# EAGLE design tinyPipes-tinyComponents (EAGLE 6.5.0)

## Sheet 1 of 3
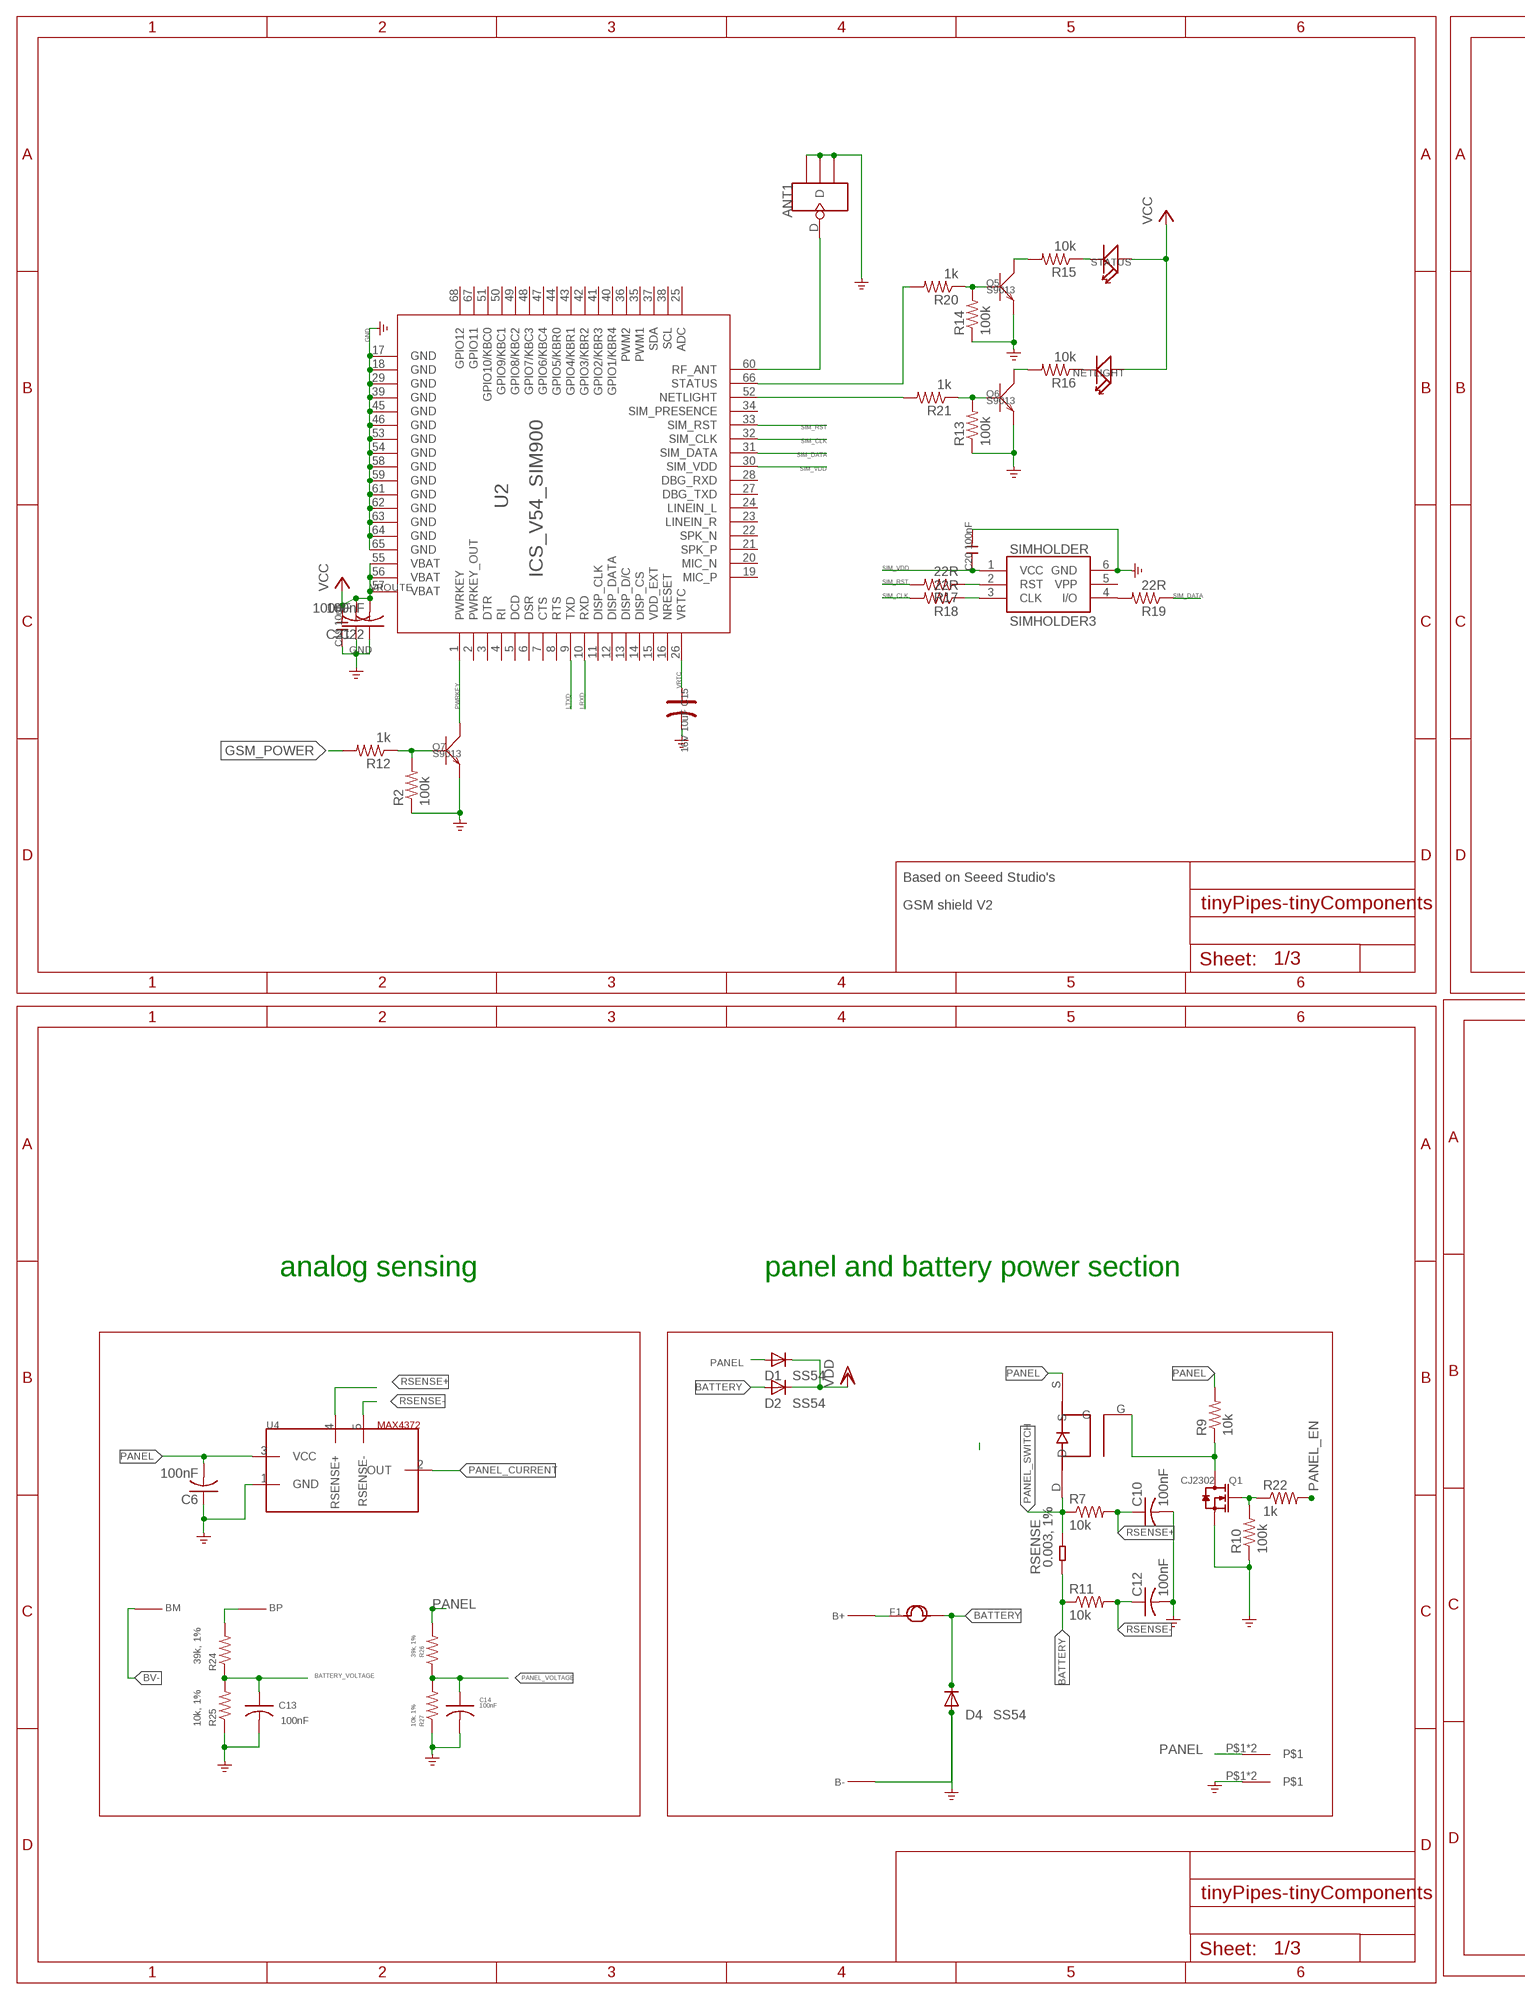
[diagram p0: schematic, sheet 1, part 1 of 2]
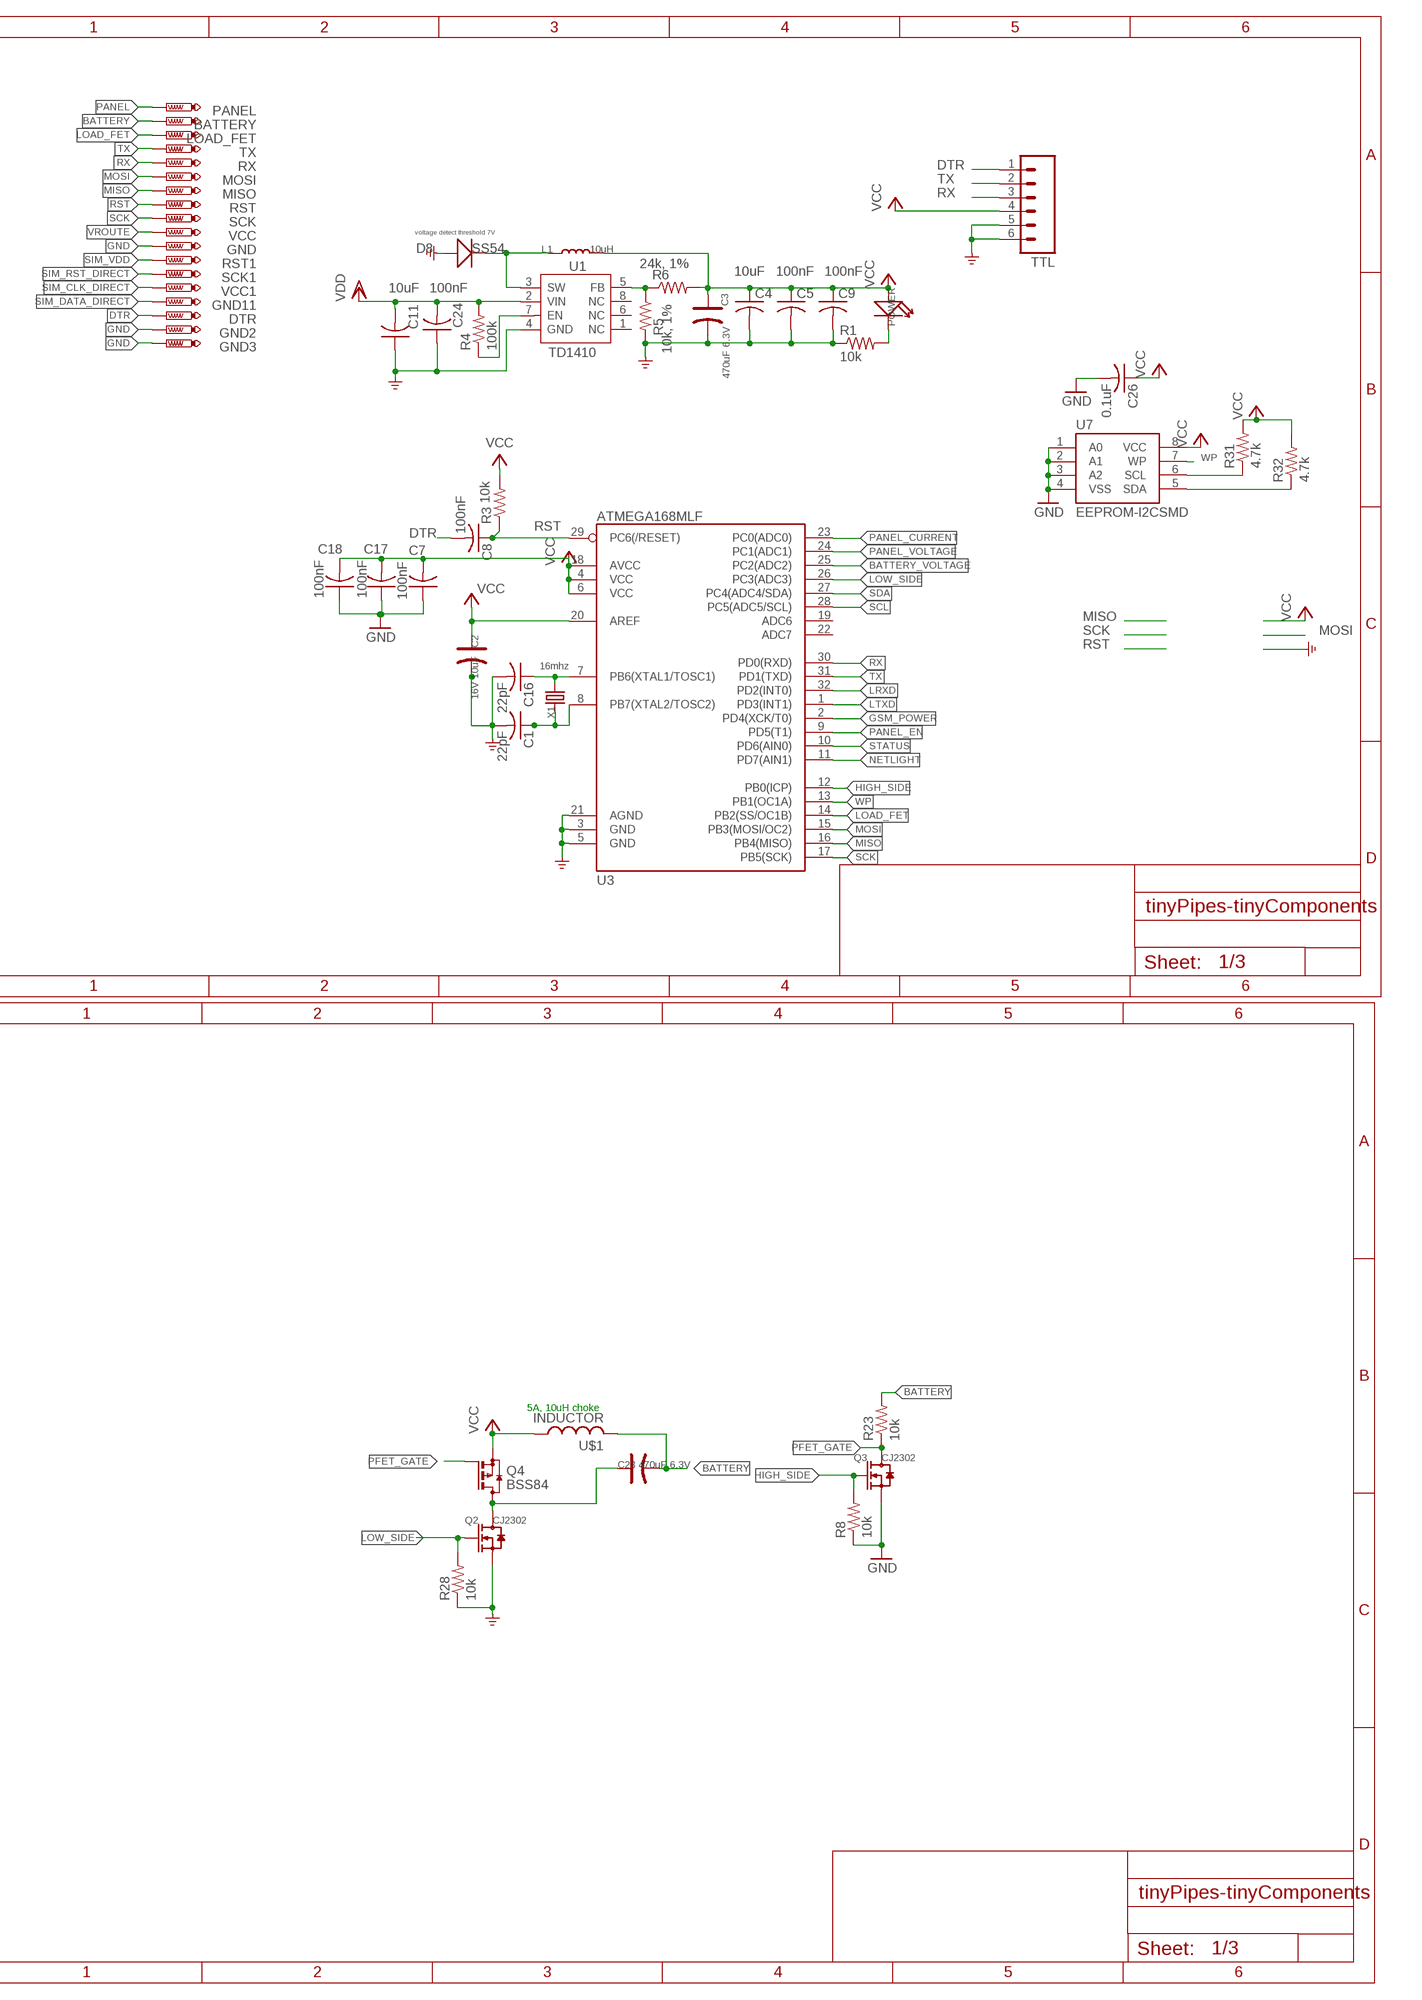
[diagram p1: schematic, sheet 1, part 2 of 2]

### Parts
ANT1  ANTENNA-U-FL  [4P-U-FL]
B+  TINYPIPES_BATTBATT  [TINYPIPES_BATT]
B-  TINYPIPES_BATTBATT  [TINYPIPES_BATT]
BATTERY  PTR1B2,54  [B2,54]
BM  TINYPIPES_BATTSBATT  [TINYPIPES_SBATT]
BP  TINYPIPES_BATTSBATT  [TINYPIPES_SBATT]
C1  22pF  C-USC0201  [C0201]
C2  16V 10uF  CAP-AVX-A  [AVX-A]
C3  470uF 6.3V  CAP-AVX-D  [AVX-D]
C4  10uF  C-USC0805  [C0805]
C5  100nF  C-USC0402  [C0402]
C6  100nF  C-USC0402  [C0402]
C7  100nF  C-USC0402  [C0402]
C8  100nF  C-USC0402  [C0402]
C9  100nF  C-USC0402  [C0402]
C10  100nF  C-USC0402  [C0402]
C11  10uF  C-USC0402  [C0402]
C12  100nF  C-USC0402  [C0402]
C13  100nF  C-USC0402  [C0402]
C14  100nF  C-USC0402  [C0402]
C15  16V 10uF  CAP-AVX-A  [AVX-A]
C16  22pF  C-USC0201  [C0201]
C17  100nF  C-USC0402  [C0402]
C18  100nF  C-USC0402  [C0402]
C19  10uF  C-0805  [C0805]
C20  100nF  C-0603  [C0603]
C21  100nF  C-USC0402  [C0402]
C22  100nF  C-USC0402  [C0402]
C23  470uF 6.3V  CAP-AVX-D  [AVX-D]
C24  100nF  C-USC0402  [C0402]
C26  0.1uF  C-USC0402  [C0402]
D1  SS54  DIODE-SMB  [SMB]
D2  SS54  DIODE-SMB  [SMB]
D4  SS54  DIODE-SMB  [SMB]
D8  SS54  D'MBRS240LT3'  [SMB]
DTR  PTR1B2,54  [B2,54]
F1  FUSE16R700  [0210]
GND  PTR1B2,54  [B2,54]
GND2  PTR1B2,54  [B2,54]
GND3  PTR1B2,54  [B2,54]
GND11  PTR1B2,54  [B2,54]
L1  10uH  L'0630'  [L0630]
LOAD_FET  PTR1B2,54  [B2,54]
MISO  PTR1B2,54  [B2,54]
MOSI  PTR1B2,54  [B2,54]
NETLIGHT  LED'0603'  [LED-0603]
PANEL  PTR1B2,54  [B2,54]
PANEL+  TINYPIPES_BATTPANEL  [TINYPIPES_PANEL]
PANEL-  TINYPIPES_BATTPANEL  [TINYPIPES_PANEL]
POWER  LED'0603'  [LED-0603]
Q1  CJ2302  MOSFET-N'SOT23'  [SOT23]
Q2  CJ2302  MOSFET-N'SOT23'  [SOT23]
Q3  CJ2302  MOSFET-N'SOT23'  [SOT23]
Q4  BSS84  [SOT23]
Q5  S9013  TRANSISTOR-NPN-SOT23  [SOT23]
Q6  S9013  TRANSISTOR-NPN-SOT23  [SOT23]
Q7  S9013  TRANSISTOR-NPN-SOT23  [SOT23]
R1  10k  R-US_R0201  [R0201]
R2  100k  R-US_R0201  [R0201]
R3  10k  R-US_R0201  [R0201]
R4  100k  R-US_R0201  [R0201]
R5  10k, 1%  R-US_R0201  [R0201]
R6  24k, 1%  R-US_R0201  [R0201]
R7  10k  R-US_R0201  [R0201]
R8  10k  R-US_R0201  [R0201]
R9  10k  R-US_R0201  [R0201]
R10  100k  R-US_R0201  [R0201]
R11  10k  R-US_R0201  [R0201]
R12  1k  R-US_R0201  [R0201]
R13  100k  R-US_R0201  [R0201]
R14  100k  R-US_R0201  [R0201]
R15  10k  R-US_R0201  [R0201]
R16  10k  R-US_R0201  [R0201]
R17  22R  R-US_R0201  [R0201]
R18  22R  R-US_R0201  [R0201]
R19  22R  R-US_R0201  [R0201]
R20  1k  R-US_R0201  [R0201]
R21  1k  R-US_R0201  [R0201]
R22  1k  R-US_R0201  [R0201]
R23  10k  R-US_R0201  [R0201]
R24  39k, 1%  R-US_R0201  [R0201]
R25  10k, 1%  R-US_R0201  [R0201]
R26  39k, 1%  R-US_R0201  [R0201]
R27  10k, 1%  R-US_R0201  [R0201]
R28  10k  R-US_R0201  [R0201]
R31  4.7k  R-US_R0201  [R0201]
R32  4.7k  R-US_R0201  [R0201]
RSENSE  0.003, 1%  R-2512  [R2512]
RST  PTR1B2,54  [B2,54]
RST1  PTR1B2,54  [B2,54]
RX  PTR1B2,54  [B2,54]
SCK  PTR1B2,54  [B2,54]
SCK1  PTR1B2,54  [B2,54]
SIMHOLDER  SIMHOLDER3  [SIMHOLDER3]
STATUS  LED'0603'  [LED-0603]
TTL  M06LOCK  [1X06_LOCK]
TX  PTR1B2,54  [B2,54]
U1  TD1410  [SOP8]
U2  ICS_V54_SIM900  [ICS_V54_SIM900]
U3  ATMEGA168MLF  [MLF32]
U4  MAX4372  [SOT23-5]
U5  SI4435POWER  [SO8_FET]
U7  EEPROM-I2CSMD  [SO08]
U$1  INDUCTOR  [10UH_5A_INDUCTOR]
VCC  PTR1B2,54  [B2,54]
VCC1  PTR1B2,54  [B2,54]
X1  16mhz  CRYSTAL  [SMD-4_CRYSTAL]

### Nets
B+: B+.1 F1.1
B-: B-.1 D4.A
BATTERY [power]: BATTERY.TP C23.- D2.A D4.C F1.2 R11.1 R23.2 RSENSE.1 U$1.P$2
BATTERY_VOLTAGE: C13.1 R24.1 R25.2 U3.25(PC2(ADC2))
BV+: BP.P$1 R24.2
BV-: BM.P$1
DTR: C8.2 DTR.TP TTL.1
GND: ANT1.GND1 ANT1.GND2 ANT1.GND3 C1.2 C2.- C3.- C4.2 C5.2 C6.1 C7.1 C9.2 C10.2 C11.1 C12.2 C13.2 C14.2 C15.- C16.2 C17.1 C18.1 C19.1 C20.2 C21.1 C22.1 C24.1 C26.2 D8.+ GND2.TP GND3.TP GND.TP PANEL-.P$1 PANEL-.P$2 Q1.2(S) Q2.2(S) Q3.2(S) Q5.2(E) Q6.2(E) Q7.2(E) R1.1 R2.1 R5.2 R8.1 R10.1 R13.1 R14.1 R25.1 R27.1 R28.1 SIMHOLDER.6(GND) TTL.5 TTL.6 U1.4(GND) U2.17(GND) U2.18(GND) U2.29(GND) U2.39(GND) U2.45(GND) U2.46(GND) U2.53(GND) U2.54(GND) U2.58(GND) U2.59(GND) U2.61(GND) U2.62(GND) U2.63(GND) U2.64(GND) U2.65(GND) U3.3(GND) U3.5(GND) U3.21(AGND) U4.1(GND) U7.1(A0) U7.2(A1) U7.3(A2) U7.4(VSS)
GSM_POWER: R12.2 U3.2(PD4(XCK/T0))
HIGH_SIDE: Q3.1(G) R8.2 U3.12(PB0(ICP))
LOAD_FET: LOAD_FET.TP U3.14(PB2(SS/OC1B))
LOW_SIDE: Q2.1(G) R28.2 U3.26(PC3(ADC3))
LRXD: U2.10(RXD) U3.32(PD2(INT0))
LTXD: U2.9(TXD) U3.1(PD3(INT1))
MISO: MISO.TP U3.16(PB4(MISO))
MOSI: MOSI.TP U3.15(PB3(MOSI/OC2))
N$1: ANT1.D U2.60(RF_ANT)
N$2: C16.1 U3.7(PB6(XTAL1/TOSC1)) X1.3
N$3: Q6.3(C) R16.2
N$4: Q7.1(B) R2.2 R12.1
N$5: Q5.1(B) R14.2 R20.1
N$6: Q6.1(B) R13.2 R21.1
N$7: NETLIGHT.- R16.1
N$8: Q5.3(C) R15.2
N$9: POWER.- R1.2
N$11: Q1.1(G) R10.2 R22.1
N$12: R4.1 U1.7(EN)
N$13: C1.1 U3.8(PB7(XTAL2/TOSC2)) X1.1
N$15: Q1.3(D) R9.1 U5.G
N$16: R15.1 STATUS.-
N$17: C23.+ Q2.3(D) Q4.3(D)
N$38: D8.- L1.1 U1.3(SW)
N$47: R5.1 R6.1 U1.5(FB)
NETLIGHT: R21.2 U2.52(NETLIGHT) U3.11(PD7(AIN1))
PANEL [power]: C6.2 D1.A PANEL+.P$1 PANEL+.P$2 PANEL.TP R9.2 R26.2 U4.3(VCC) U5.S
PANEL_CURRENT: U3.23(PC0(ADC0)) U4.2(OUT)
PANEL_EN: R22.2 U3.9(PD5(T1))
PANEL_SWITCH [power]: R7.1 RSENSE.2 U5.D
PANEL_VOLTAGE: C14.1 R26.1 R27.2 U3.24(PC1(ADC1))
PFET_GATE: Q3.3(D) Q4.1(G) R23.1
PWRKEY: Q7.3(C) U2.1(PWRKEY)
RSENSE+ [power]: C10.1 R7.2 U4.4(RSENSE+)
RSENSE- [power]: C12.1 R11.2 U4.5(RSENSE-)
RST: C8.1 R3.1 RST.TP U3.29(PC6(/RESET))
RX: RX.TP TTL.3 U3.30(PD0(RXD))
SCK: SCK.TP U3.17(PB5(SCK))
SCL: R31.1 U3.28(PC5(ADC5/SCL)) U7.6(SCL)
SDA: R32.1 U3.27(PC4(ADC4/SDA)) U7.5(SDA)
SIM_CLK: R18.2 U2.32(SIM_CLK)
SIM_CLK_DIRECT: R18.1 SIMHOLDER.3(CLK) VCC1.TP
SIM_DATA: R19.1 U2.31(SIM_DATA)
SIM_DATA_DIRECT: GND11.TP R19.2 SIMHOLDER.4(I/O)
SIM_RST: R17.2 U2.33(SIM_RST)
SIM_RST_DIRECT: R17.1 SCK1.TP SIMHOLDER.2(RST)
SIM_VDD: C20.1 RST1.TP SIMHOLDER.1(VCC) U2.30(SIM_VDD)
STATUS: R20.2 U2.66(STATUS) U3.10(PD6(AIN0))
TX: TTL.2 TX.TP U3.31(PD1(TXD))
VCC: Q4.2(S) U$1.P$1
VDD: C11.2 C24.2 D1.C D2.C R4.2 U1.2(VIN)
VROUTE: C2.+ C3.+ C4.1 C5.1 C7.2 C9.1 C17.2 C18.2 C19.2 C21.2 C22.2 C26.1 L1.2 NETLIGHT.+ POWER.+ R3.2 R6.2 R31.2 R32.2 STATUS.+ TTL.4 U2.55(VBAT) U2.56(VBAT) U2.57(VBAT) U3.4(VCC) U3.6(VCC) U3.18(AVCC) U3.20(AREF) U7.8(VCC) VCC.TP ; supply symbol labelled VCC
VRTC: C15.+ U2.26(VRTC)
WP: U3.13(PB1(OC1A)) U7.7(WP)
Unconnected: SIMHOLDER.5(VPP) U1.1(NC) U1.6(NC) U1.8(NC) U2.2(PWRKEY_OUT) U2.3(DTR) U2.4(RI) U2.5(DCD) U2.6(DSR) U2.7(CTS) U2.8(RTS) U2.11(DISP_CLK) U2.12(DISP_DATA) U2.13(DISP_D/C) U2.14(DISP_CS) U2.15(VDD_EXT) U2.16(NRESET) U2.19(MIC_P) U2.20(MIC_N) U2.21(SPK_P) U2.22(SPK_N) U2.23(LINEIN_R) U2.24(LINEIN_L) U2.25(ADC) U2.27(DBG_TXD) U2.28(DBG_RXD) U2.34(SIM_PRESENCE) U2.35(PWM1) U2.36(PWM2) U2.37(SDA) U2.38(SCL) U2.40(GPIO1/KBR4) U2.41(GPIO2/KBR3) U2.42(GPIO3/KBR2) U2.43(GPIO4/KBR1) U2.44(GPIO5/KBR0) U2.47(GPIO6/KBC4) U2.48(GPIO7/KBC3) U2.49(GPIO8/KBC2) U2.50(GPIO9/KBC1) U2.51(GPIO10/KBC0) U2.67(GPIO11) U2.68(GPIO12) U3.19(ADC6) U3.22(ADC7)

### Notes on the sheet
- voltage detect threshold 7V
- Based on Seeed Studio's
- GSM shield V2
- analog sensing | panel and battery power section
- 5A, 10uH choke

## Sheet 2 of 3

## Sheet 3 of 3

## Library data of the parts
ANT1 = Connector:ANTENNA-U-FL
B+ B- BM BP = tinyPipes v2.6:TINYPIPES_BATT
BATTERY DTR GND GND2 GND3 GND11 LOAD_FET MISO MOSI PANEL RST RST1 RX SCK SCK1 TX VCC VCC1 = testpad:PTR1: TEST PIN
C1 C4-C14 C16-C18 C21 C22 C24 C26 = rcl:C-US: CAPACITOR, American symbol
C2 C3 C15 C23 = Discrete:CAP*: Electrolytic Capacitors,Tantalum Capacitors and Super Capacitors
C19 C20 = Discrete:C*: Ceramic Capacitors
D1 D2 D4 = diode:DIODE-: DIODE
D8 = Discrete:D*
F1 = tinyPipes v2.6:FUSE
L1 = Discrete:L*
NETLIGHT POWER STATUS = Discrete:LED*
PANEL+ PANEL- = tinyPipes_v2.5:TINYPIPES_BATT
Q1-Q3 = Discrete:MOSFET-N: IRLL014: http://www.vishay.com/docs/91319/sihll014.pdf
Q4 = transistor-small-signal:BSS84: P-CHANNEL MOS FET
Q5-Q7 = Discrete:TRANSISTOR-NPN*: NPN audion
R1-R28 R31 R32 = rcl:R-US_: RESISTOR, American symbol
RSENSE = Discrete:R*
SIMHOLDER = SparkFun2:SIMHOLDER3
TTL = SparkFun-Connectors:M06: Header 6 Standard 6-pin 0.1" header. Use with straight break away headers (SKU : PRT-00116), right angle break away headers (PRT-00553), swiss pins (PRT-00743), machine pins (PRT-00117), and female headers (PRT-00115). Molex polarized connector foot print use with SKU : PRT-08094 with associated crimp pins and housings. NOTES ON THE VARIANTS LOCK and LOCK_LONGPADS... This footprint was designed to help hold the alignment of a through-hole component (i.e. 6-pin header) while soldering it into place. You may notice that each hole has been shifted either up or down by 0.005 of an inch from it's more standard position (which is a perfectly straight line). This slight alteration caused the pins (the squares in the middle) to touch the edges of the holes. Because they are alternating, it causes a "brace" to hold the component in place. 0.005 has proven to be the perfect amount of "off-center" position when using our standard breakaway headers. Although looks a little odd when you look at the bare footprint, once you have a header in there, the alteration is very hard to notice. Also,if you push a header all the way into place, it is covered up entirely on the bottom side. This idea of altering the position of holes to aid alignment will be further integrated into the Sparkfun Library for other footprints. It can help hold any component with 3 or more connection pins.
U1 = template:TD1410: 2A 380KHz 20V PWM Buck DC/DC Converter
U2 = tinyPipes v2.2:ICS_V54_SIM900
U3 = tinyPipes:ATMEGA168
U4 = tinyPipes:MAX4372
U5 = tinyPipes:SI4435
U7 = SparkFun-DigitalIC:EEPROM-I2C: I2C EEPROM chips, 24LC256 (and others)
U$1 = tinyPipes:INDUCTOR
X1 = tinyPipes:CRYSTAL

## Board
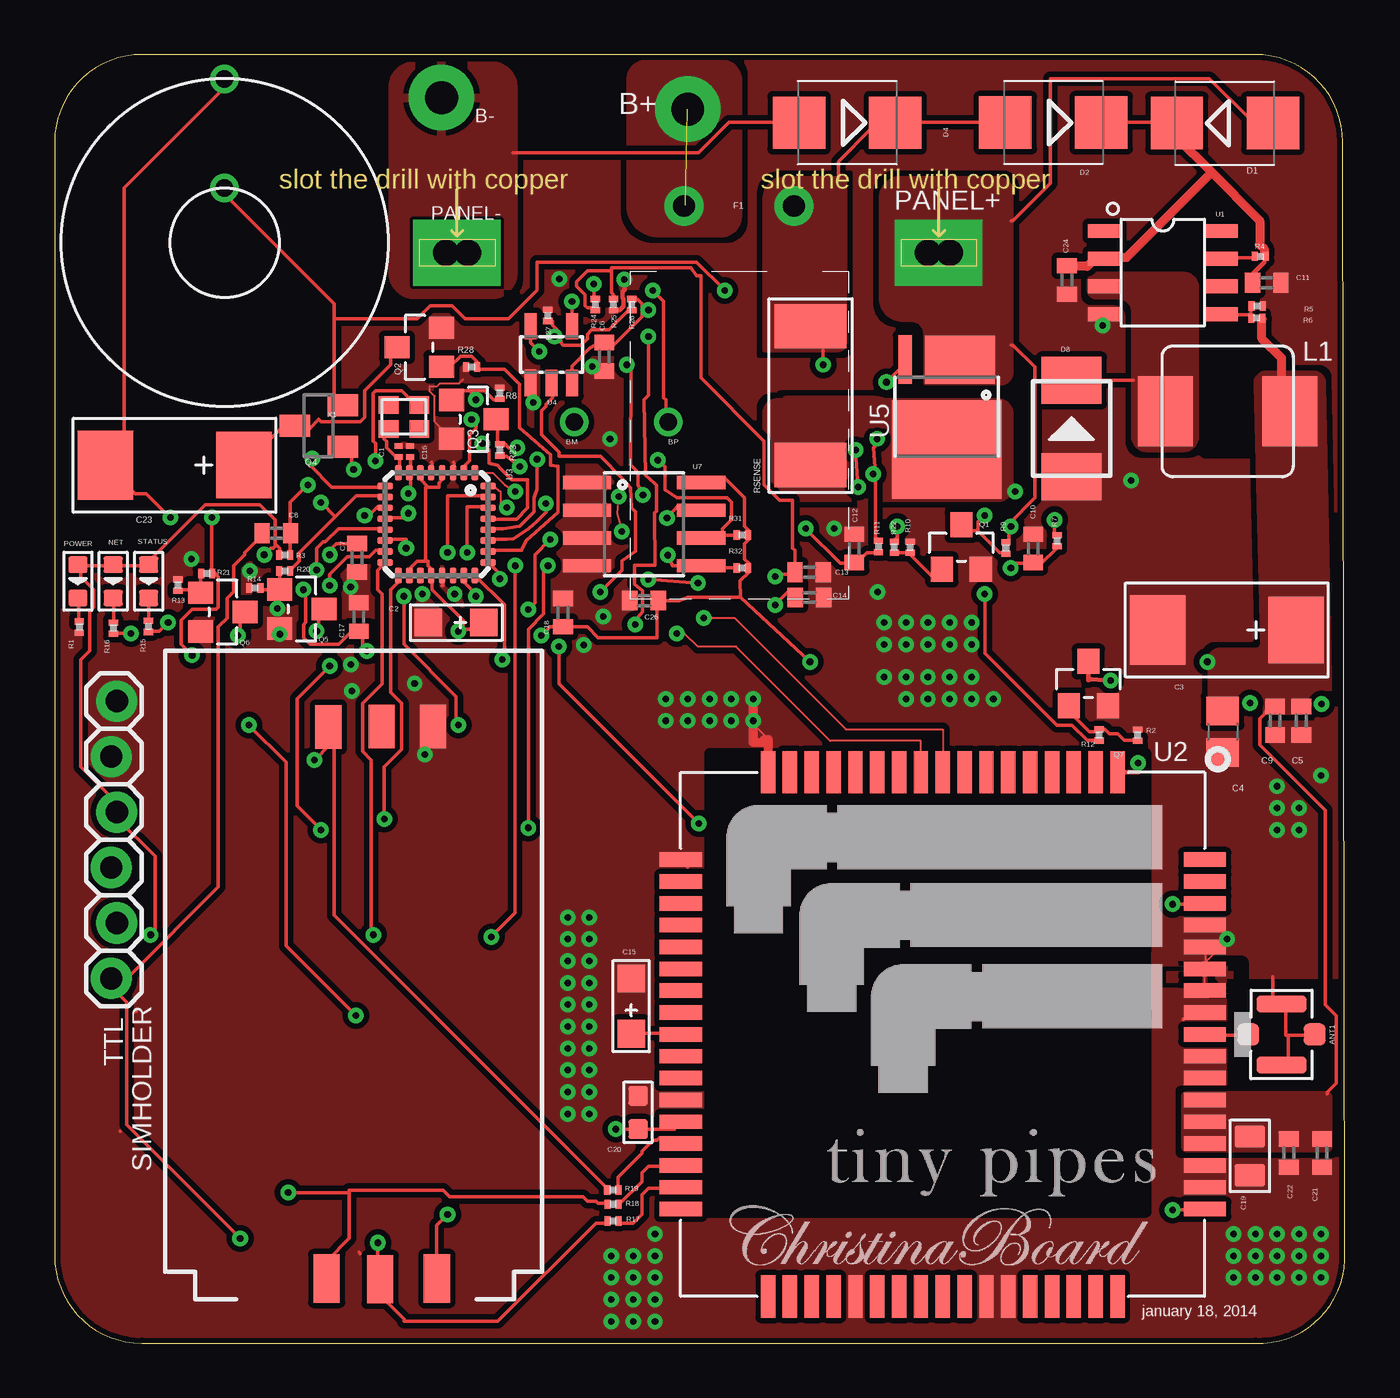
[diagram p2: board, top side]
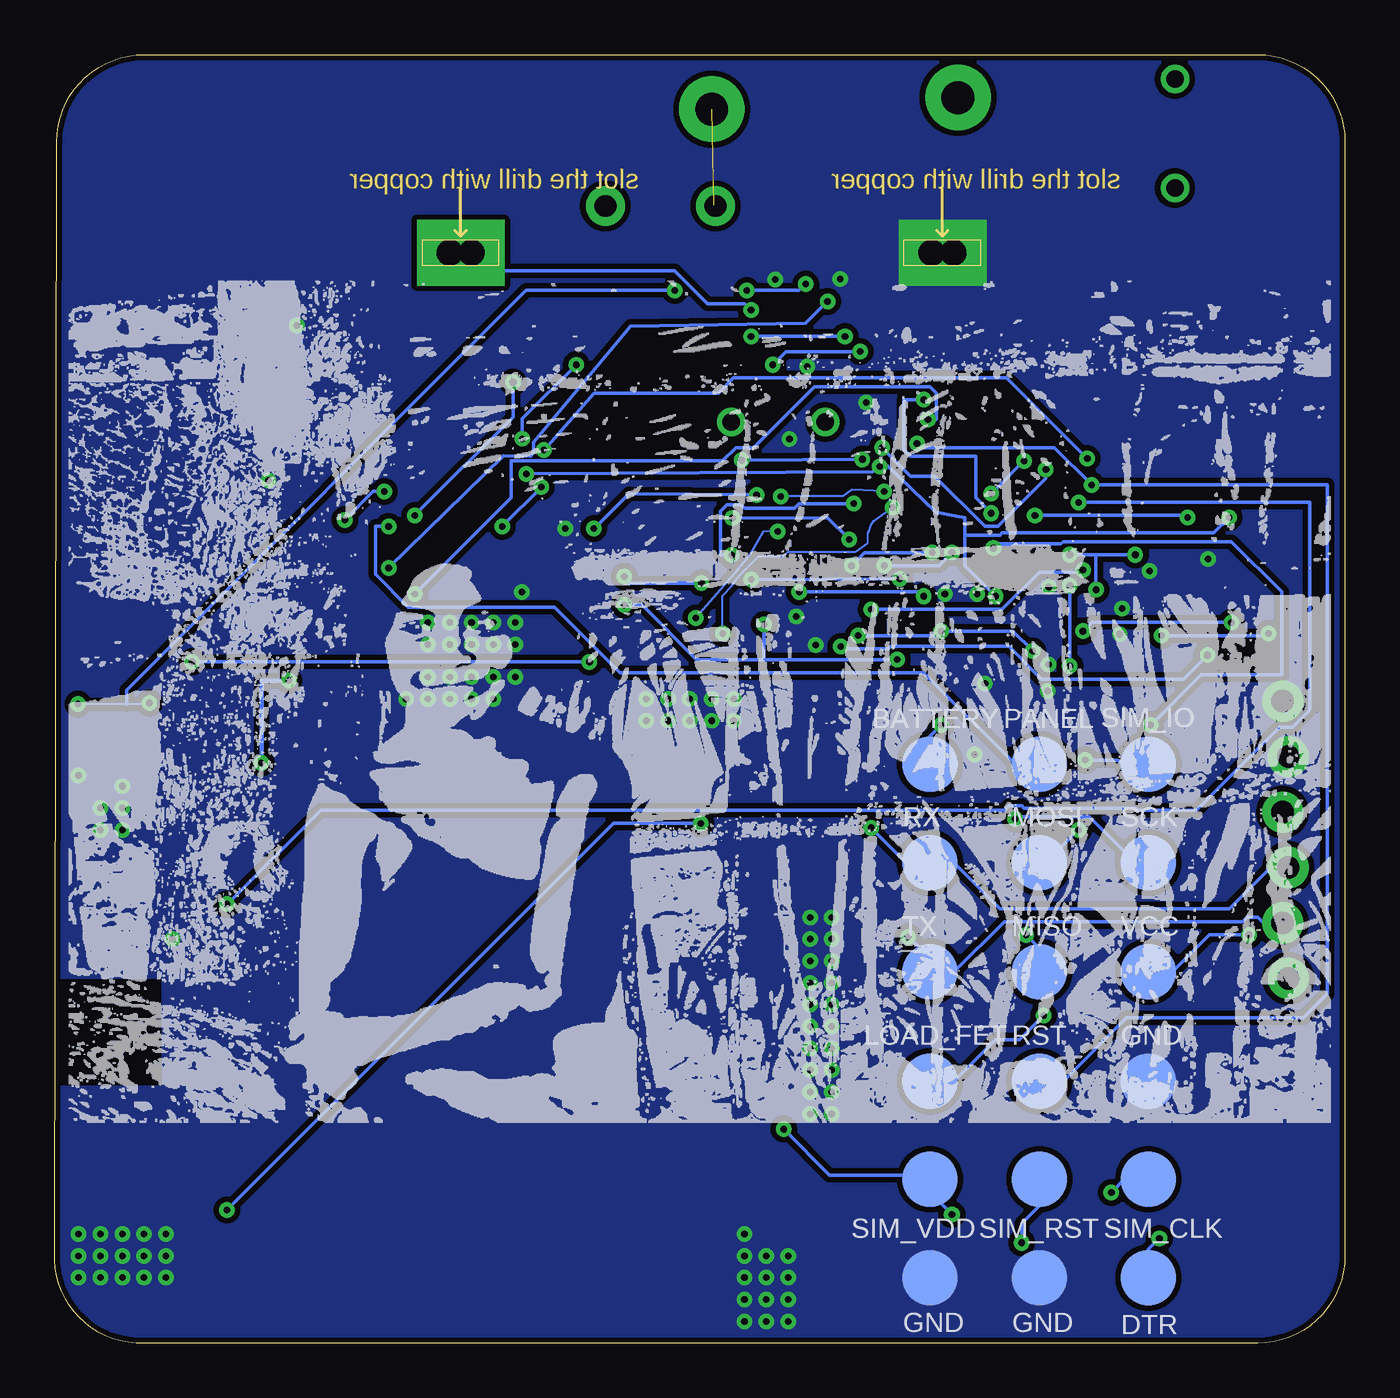
[diagram p3: board, bottom side, seen from below]

Size 59.1 x 59 mm. Coordinates in mm from the lower left corner, seen from the top.
Outline: 0,55 0,4 arc90 4,0 55,0 arc90 59.1,3.8 59,55 arc90 55,59 4,59 arc90 0,55
Copper layers (1*16): Top 0.035mm / dielectric 1.5mm / Bottom 0.035mm
Design rules "default *": minimum track width 6mil, minimum drill 12mil, track to track 6mil, track to pad 6mil, pad to pad 6mil, via to via 6mil, smd to smd 0mil, copper to edge 10mil, drill to drill 8mil, minimum pad ring 10mil, minimum via ring 8mil, stop-mask expansion 4mil, vias tented up to drill 0.7mm, thermal gap 10mil
tRestrict: area 30,6 to 50,27; area 52.7,40.8 to 54.6,44.6; 8 lines

### Footprints (pad centres in the part's own frame; a part is rotated, then mirrored left to right if it is on the bottom)
4P-U-FL = smd 1.016 x 1.016: D -1.524,0; GND3 1.524,0 | smd 2.286 x 0.762: GND1 0,1.397; GND2 0,-1.397
TINYPIPES_BATT = drill 1.5 pad 3: 1 0,0
B2,54 = smd 2.54 x 2.54: TP 0,0
TINYPIPES_SBATT = drill 0.8: P$1 0,0
C0201 = smd 0.25 x 0.35: 1 -0.25,0; 2 0.25,0
AVX-A = smd 1.27 x 1.27: + -1.27,0; - 1.27,0
AVX-D = smd 2.54 x 3.048: + -3.175,0 | smd 2.54 x 3.175: - 3.175,0
C0805 = smd 1.3 x 1.5: 1 -0.95,0; 2 0.95,0
C0402 = smd 0.7 x 0.9: 1 -0.65,0; 2 0.65,0
C0805' = smd 1.016 x 1.397: 1 -0.889,0; 2 0.889,0
C0603 = smd 0.889 x 0.889: 1 -0.762,0; 2 0.762,0
SMB = smd 2.4 x 2.4: A 2.2,0; C -2.2,0
SMB' = smd 2.159 x 2.743: + -2.21,0; - 2.21,0
0210 = drill 1 pad 1.8: 1 -2.54,0; 2 2.5,0
L0630 = smd 2.5 x 3.2: 1 -2.85,0; 2 2.85,0
LED-0603 = smd 0.762 x 0.889: + -0.762,0; - 0.762,0
TINYPIPES_PANEL = drill 1.2 pad 3 square: P$1 -0.492,0; P$2 0.508,0
SOT23 = smd 1.016 x 1.143: 1 -0.889,-1.016; 2 0.889,-1.016; 3 0,1.016
SOT23' = smd 1 x 1.4: 1 -0.95,-1.1; 2 0.95,-1.1; 3 0,1.1
R0201 = smd 0.28 x 0.43: 1 -0.255,0; 2 0.255,0
R2512 = smd 2.032 x 3.302: 1 -3.175,0; 2 3.175,0
SIMHOLDER3 = smd 2.2 x 1.2: 1 0.95,4.81; 2 0.91,7.41; 3 0.95,9.86 | smd 2 x 1.2: 4 26.2,9.78; 5 26.22,7.34; 6 26.22,4.98
1X06_LOCK = drill 1.016 pad 1.88: 1 0,0; 2 2.54,-0.254; 3 5.08,0; 4 7.62,-0.254; 5 10.16,0; 6 12.7,-0.254
SOP8 = smd 0.635 x 1.524: 1 -1.905,-2.667; 2 -0.635,-2.667; 3 0.635,-2.667; 4 1.905,-2.667; 5 1.905,2.667; 6 0.635,2.667; 7 -0.635,2.667; 8 -1.905,2.667
ICS_V54_SIM900 = smd 1.93 x 0.66: 1 -12,8; 2 -12,7; 3 -12,6; 4 -12,5; 5 -12,4; 6 -12,3; 7 -12,2; 8 -12,1; 9 -12,0; 10 -12,-1; 11 -12,-2; 12 -12,-3; 13 -12,-4; 14 -12,-5; 15 -12,-6; 16 -12,-7; 17 -12,-8; 35 12,-8; 36 12,-7; 37 12,-6; 38 12,-5; 39 12,-4; 40 12,-3; 41 12,-2; 42 12,-1; 43 12,0; 44 12,1; 45 12,2; 46 12,3; 47 12,4; 48 12,5; 49 12,6; 50 12,7; 51 12,8 | smd 0.66 x 1.93: 18 -8,-12; 19 -7,-12; 20 -6,-12; 21 -5,-12; 22 -4,-12; 23 -3,-12; 24 -2,-12; 25 -1,-12; 26 0,-12; 27 1,-12; 28 2,-12; 29 3,-12; 30 4,-12; 31 5,-12; 32 6,-12; 33 7,-12; 34 8,-12; 52 8,12; 53 7,12; 54 6,12; 55 5,12; 56 4,12; 57 3,12; 58 2,12; 59 1,12; 60 0,12; 61 -1,12; 62 -2,12; 63 -3,12; 64 -4,12; 65 -5,12; 66 -6,12; 67 -7,12; 68 -8,12
MLF32 = smd 0.7 x 0.3: 1 -2.35,1.75; 2 -2.35,1.25; 3 -2.35,0.75; 4 -2.35,0.25; 5 -2.35,-0.25; 6 -2.35,-0.75; 7 -2.35,-1.25; 8 -2.35,-1.75; 17 2.35,-1.75; 18 2.35,-1.25; 19 2.35,-0.75; 20 2.35,-0.25; 21 2.35,0.25; 22 2.35,0.75; 23 2.35,1.25; 24 2.35,1.75 | smd 0.3 x 0.7: 9 -1.75,-2.35; 10 -1.25,-2.35; 11 -0.75,-2.35; 12 -0.25,-2.35; 13 0.25,-2.35; 14 0.75,-2.35; 15 1.25,-2.35; 16 1.75,-2.35; 25 1.75,2.35; 26 1.25,2.35; 27 0.75,2.35; 28 0.25,2.35; 29 -0.25,2.35; 30 -0.75,2.35; 31 -1.25,2.35; 32 -1.75,2.35
SOT23-5 = smd 0.55 x 1.2: 1 -0.95,-1.3; 2 0,-1.3; 3 0.95,-1.3; 4 0.95,1.3; 5 -0.95,1.3
SO8_FET = smd 5 x 4.5: D 0,1.5 | smd 0.61 x 2.21: G 1.905,-2.616 | smd 3.2 x 2.2: S -0.6,-2.6
SO08 = smd 0.61 x 2.21: 1 -1.905,-2.616; 2 -0.635,-2.616; 3 0.635,-2.616; 4 1.905,-2.616; 5 1.905,2.616; 6 0.635,2.616; 7 -0.635,2.616; 8 -1.905,2.616
10UH_5A_INDUCTOR = drill 0.8: P$1 0,2.5; P$2 0,7.5
SMD-4_CRYSTAL = smd 0.9 x 0.8: 1 -0.7,-0.55; 2 0.7,-0.55; 3 0.7,0.55; 4 -0.7,0.55

### Placement (x,y rotation side)
ANT1  56.19,14.14 0 top
B+  29,56.5 0 top
B-  17.73,57.03 0 top
BATTERY  19,26.5 0 bottom
BM  23.8,42.17 0 top
BP  28.1,42.17 0 top
C1  15.76,40.83 90 top
C2  18.39,32.99 180 top
C3  53.69,32.65 180 top
C4  53.5,28 270 top
C5  57.1,28.5 270 top
C6  25.17,45.17 90 top
C7  13.85,35.97 90 top
C8  10.16,37.08 180 top
C9  55.9,28.5 270 top
C10  44.81,36.39 90 top
C11  55.51,48.56 180 top
C12  36.62,36.39 90 top
C13  34.56,35.3 0 top
C14  34.58,34.15 0 top
C15  26.41,15.43 90 top
C16  16.28,40.84 90 top
C17  13.94,33.25 270 top
C18  23.29,33.45 270 top
C19  10uF  [C0805']  54.75,8.58 90 top
C20  26.73,10.57 90 top
C21  58.05,8.7 90 top
C22  56.53,8.7 90 top
C23  5.5,40.2 180 top
C24  46.37,48.68 90 top
C26  27,34 180 top
D1  53.6,55.86 0 top
D2  45.74,55.89 180 top
D4  36.3,55.88 180 top
D8  SS54  [SMB']  46.58,41.88 90 top
DTR  9,3 0 bottom
F1  31.37,52.07 0 top
GND  9,12 0 bottom
GND2  14,3 0 bottom
GND3  19,3 0 bottom
GND11  9,26.5 0 bottom
L1  53.73,42.67 0 top
LOAD_FET  19,12 0 bottom
MISO  14,17 0 bottom
MOSI  14,22 0 bottom
NETLIGHT  2.69,34.88 270 top
PANEL  14,26.5 0 bottom
PANEL+  40.5,49.93 180 top
PANEL-  18.44,49.93 180 top
POWER  1.07,34.88 270 top
Q1  41.53,36.45 0 top
Q2  16.7,45.6 90 top
Q3  19.2,42.3 270 top
Q4  BSS84  [SOT23']  12.1,42 90 top
Q5  11.33,33.62 270 top
Q6  7.71,33.48 270 top
Q7  47.35,30.2 0 top
R1  1.13,32.79 90 top
R2  49.61,27.84 270 top
R3  10.54,36.08 180 top
R4  55.23,49.77 0 top
R5  55.08,47.48 0 top
R6  55.06,46.93 0 top
R7  45.91,36.74 270 top
R8  20.4,43.5 270 top
R9  43.57,36.41 90 top
R10  39.19,36.44 270 top
R11  37.74,36.48 270 top
R12  47.84,27.85 270 top
R13  5.64,34.71 270 top
R14  9.17,34.57 0 top
R15  4.31,32.82 270 top
R16  2.69,32.74 270 top
R17  25.58,5.6 0 top
R18  25.58,6.36 0 top
R19  25.57,7.02 180 top
R20  10.54,35.35 0 top
R21  6.97,35.24 0 top
R22  38.47,36.45 90 top
R23  20.4,40.9 270 top
R24  24.76,47.56 90 top
R25  25.6,47.56 90 top
R26  26.45,47.56 90 top
R27  22.6,47.06 270 top
R28  19.1,44.7 0 top
R31  31.5,37 0 top
R32  31.5,35.5 0 top
RSENSE  34.63,43.39 270 top
RST  14,12 0 bottom
RST1  19,7.5 0 bottom
RX  19,22 0 bottom
SCK  9,22 0 bottom
SCK1  14,7.5 0 bottom
SIMHOLDER  22.32,2.01 90 top
STATUS  4.31,34.88 270 top
TTL  2.6,16.7 90 top
TX  19,17 0 bottom
U1  50.76,49.02 270 top
U2  40.68,14.14 270 top
U3  17.5,37.5 270 top
U4  22.76,45.27 0 top
U5  40.86,42.42 180 top
U7  27,37.5 270 top
U$1  7.79,50.39 0 top
VCC  9,17 0 bottom
VCC1  9,7.5 0 bottom
X1  16,42.41 0 top

### Tracks (layer width: path | path; a pad name or v marks a point on that pad's centre or on a via)
B+  (1 unrouted)
  Top 0.152: 28.9,52.1 F1.1
  pour Top (isolate 0.254, no thermals): 26.29,52.08 26.29,57.86 arc-90 27.1,58.67 30.57,58.67 arc-90 31.39,57.86 31.39,51.58 arc-90 30.53,50.73 27.64,50.73 arc-90
B-
  Top 0.152: 21,54.5 29.5,54.5 30.9,55.9 34.1,55.9 D4.A
  pour Top: 15.5,49 15.5,57.5 arc-90 16.5,58.5 20,58.5 arc-90 21,57.5 21,49 arc-90 20,48 16.5,48 arc-90
BATTERY  (via drill 0.3)
  Top 0.152: U$1.P$2 7.8,58.1 7.8,57.5 3.2,52.9 3.2,41.8 2.3,40.9 2.3,40.2 C23.- 2.4,40.2 3.7,38.9 4.2,38.9 v5.3,37.8 | v37.68,41.41 37.56,41.03 37.5,41 37.6,39.8 | 37.6,39.8 37.6,36.9 37.7,36.8 R11.1 | 35.2,45.47 v35.2,44.8 | v21.31,40.14 20.7,40.6 20.4,40.6 R23.2 | 37.6,39.8 v37.5,39.8 | 38.5,55.9 37.4,55.9 37.4,55.6 35.9,54.1 35.9,53.34 | 38.5,55.9 43.5,55.9 D2.A | 38.5,55.9 D4.C | v18.5,28.3 18.4,28.4 18.4,29.6 16,32 v16,34.2
  Bottom 0.152: v37.68,41.41 37.68,42.32 v35.2,44.8 | v37.5,39.8 21.65,39.9 v21.31,40.14 20.95,40.17 18.73,38.04 17.4,37.8 17.4,37 | BATTERY.TP 19,27.8 v18.5,28.3 | v16,34.2 17.4,35.6 17.4,37 | v5.3,37.8 6,37.1 15.7,37.1 15.8,37 17.4,37
  pour Top (isolate 0.254, no thermals): 35.84,45.47 32.51,45.47 32.51,52.35 arc-90 33.5,53.34 36.2,53.34 36.2,45.83 arc-90
BATTERY_VOLTAGE  (via drill 0.3)
  Top 0.152: 25.5,49.1 24.4,49.1 23.9,48.6 23.9,48.4 24.3,48 24.3,47.5 24.4,47.4 24.7,47.4 R24.1 | 25.5,49.1 25.5,48.1 25.6,48 25.6,47.9 R25.2 | 25.5,49.1 25.51,49.24 29.16,49.24 29.39,48.88 29.61,48.88 29.6,44.2 32.5,41.3 32.5,39.3 33.2,38.6 33.8,38.6 33.8,36.4 33.9,36.3 C13.1 33.9,35.2 33.1,35.2 v33,35.1 | U3.25 20.4,35.2 v20.4,35 | v29.47,34.8 v27.2,34.97
  Bottom 0.152: v29.47,34.8 30.14,34.79 33,34.79 v33,35.1 | v27.2,34.97 27.16,34.96 v20.4,35
BV+  (via drill 0.3)
  Top 0.152: v24.7,48.5 24.7,47.9 R24.2 | v27.4,48.2 27.9,47.7 27.9,43.3 28,43.2 28,42.8 28.1,42.7 28.1,42.2 BP.P$1
  Bottom 0.152: v24.7,48.5 25,48.2 v27.4,48.2
DTR  (via drill 0.3)
  Top 0.152: C8.2 9.5,37 8.7,36.2 8.7,36.1 8.2,35.6 8.2,34.4 7.9,34.1 7.9,33.2 7.5,32.8 7.5,20.9 3.5,16.9 2.6,16.9 TTL.1 2.6,16.3 3.3,15.6 3.3,10 v8.5,4.8
  Bottom 0.152: DTR.TP 9,4.3 v8.5,4.8
GND  (via drill 0.3)
  Top 0.1: Q3.2 17.41,42.19 17.41,43.36 17.18,43.59 17.18,43.82 17.53,43.82 17.66,43.95 18.53,43.95 18.71,44.13 | v32,28.5 32,28.35 32.67,27.68 32.67,27.67 32.5,27.5 | U2.62 U2.63 | U2.64 52.68,18.02 52.7,18 52.7,17.09 52.73,17.06 52.73,17.46 53.74,18.47
  Top 0.152: 56.5,14.1 56.4,14.1 56.4,15.4 56.2,15.6 ANT1.GND1 56.1,15.5 55.8,15.5 55.8,16.77 | 56.5,14.1 57.7,14.1 ANT1.GND3 | 56.5,14.1 56.5,12.7 56.2,12.7 ANT1.GND2 | U3.21 17.8,35.1 17.8,34.7 17.75,34.69 | U3.5 17.3,39.9 17.3,40.3 17.27,40.33 | U3.3 18.3,39.9 18.3,40.3 18.27,40.33 | 52.5,15.93 52.5,16.1 52.6,16.1 U2.62 | 22.3,10.6 22.36,10.65 | 29,21.8 29,21.83 | 3,9.7 | 3.7,15.2 3.73,15.2 | 51.7,14.8 51.7,14.83 | 14,4.1 13.95,4.17
  Top 0.2: R25.1 25.88,47.3 26.06,47.48 26.06,47.82 26.02,47.86 26.02,48.14 26.1,48.22 v26.1,48.7
  Top 0.406: U2.17 32.69,27.64 32.5,27.64 32.5,27.5 32,27.5 v32,28.5 v32,29.5
  other vias: 48,46.6 49.3,39.5 37.7,34.4 35.7,37.3 58,5 57,5 56,5 55,5 54,5 58,4 57,4 56,4 55,4 54,4 58,3 57,3 56,3 55,3 54,3 26.5,4 26.5,3 26.5,2 27.5,5 27.5,4 27.5,3 27.5,2 27.5,1 25.5,4 25.5,3 25.5,2 25.5,1 26.5,1 23.5,19.5 23.5,18.5 23.5,17.5 23.5,16.5 23.5,15.5 24.5,19.5 24.5,18.5 24.5,17.5 24.5,16.5 24.5,15.5 24.5,14.5 24.5,13.5 24.5,12.5 24.5,11.5 24.5,10.5 23.5,14.5 23.5,13.5 23.5,12.5 23.5,11.5 23.5,10.5 31,29.5 30,29.5 29,29.5 28,29.5 25.14,33.28 24.23,31.96 18.32,34.3 16.84,34.31 13.56,34.63 10.31,32.46 8.95,35.35 6.27,35.91 10.2,33.63 13.57,31.07 13.61,29.86 16.49,30.2 16.95,26.96 57,24.5 56,25.5 58,26 56,23.5 57,23.5 56,24.5 24.62,44.71 23.11,48.72 21.93,43.08 25.44,41.4 43,29.5 42,29.5 41,29.5 40,29.5 39,29.5 42,33 41,33 40,33 39,33 38,33 42,32 41,32 40,32 39,32 38,32 42,30.5 41,30.5 40,30.5 39,30.5 38,30.5 31,28.5 30,28.5 29,28.5 28,28.5 53.7,18.5
  pour Top (isolate 0.254, rank 6, no thermals): 0,4 0,55.05 arc-90 4,59.05 55.05,59.05 arc-90 59.05,55.05 59.05,16.77 53.6,16.77 53.6,11.69 59.05,11.69 59.05,4 arc-90 55.05,0 4,0 arc-90
  pour Bottom (isolate 0.254, rank 6, no thermals): 0,0 0,55.05 arc-90 4,59.05 55.05,59.05 arc-90 59.05,55.05 59.05,16.77 54.11,16.77 54.11,11.69 59.05,11.69 59.05,4 arc-90 55.05,0
  pour Top: 50.27,15.25 53.7,15.25 53.71,15.26 53.71,17.88 50.32,17.88 50.29,17.91 50.25,17.87 50.25,15.28
GSM_POWER  (via drill 0.3)
  Top 0.152: v42.6,34.3 42.6,31.6 45.9,28.3 46.6,28.3 47.3,27.6 47.8,27.6 R12.2 | v19.1,42.3 19.3,42.1 19.3,41.9 19,41.6 19,40.4 18.8,40.2 18.8,39.9 U3.2
  Bottom 0.152: v42.6,34.3 38.2,38.7 38.2,40.4 28.5,40.4 27.9,41 27.1,41 24.3,43.8 19,43.8 18.7,43.5 18.7,42.3 v19.1,42.3
HIGH_SIDE  (via drill 0.3)
  Top 0.152: 19.1,43.6 18.4,43.6 18.4,43.3 18.2,43.1 Q3.1 | 19.1,43.6 19.7,43.6 20.1,43.2 20.4,43.2 R8.2 | v16.2,38 16.2,37.8 15.2,37.8 U3.12 | v19.3,43.2 19.1,43.4 19.1,43.6
  Bottom 0.152: v16.2,38 16.9,38.7 16.9,40.6 19.9,40.6 20.2,40.9 20.2,43.2 v19.3,43.2
LOAD_FET  (via drill 0.3)
  Top 0.152: v16.1,36.4 16.1,36.8 15.2,36.8 U3.14 | v8.9,28.3 10.6,26.6 10.6,18.2 v13.8,15
  Bottom 0.152: v16.1,36.4 15.9,36.6 13,36.6 12.9,36.7 5.2,36.7 2.9,34.4 2.9,30.6 6.6,30.6 v8.9,28.3 | v13.8,15 14.9,13.9 16,13.9 17.9,12 LOAD_FET.TP
LOW_SIDE
  Top 0.152: 19.4,44.7 19.4,44.9 19.1,45.2 18.6,45.2 18.1,44.7 17.8,44.7 Q2.1 | 19.4,44.7 19.4,44.6 20.6,44.6 21.3,43.9 21.3,43.2 21.29,43.02 21.29,41.92 22.72,40.68 22.72,40.19 23.05,40.15 23.06,38.05 21.6,36.75 21.4,36.3 19.9,36.3 U3.26 | 19.4,44.7 R28.2
LRXD  (via drill 0.3)
  Top 0.1: U3.32 20.09,39.25 20.43,38.99 20.43,38.32 20.46,38.31 20.66,38.29 20.81,38.22 v20.72,38.27 | U2.10 39.68,27.58 35.52,27.58 31.21,31.89 29.46,31.89 28.82,32.5 v28.5,32.5
  Bottom 0.1: v28.5,32.5 28.5,34.22 28.1,34.65 27.95,34.87 27.51,35.38 26.86,36.03 25.73,36.03 25.5,36.24 22.41,36.24 21.85,36.64 21.84,37.1 21.79,37.18 21.72,37.44 21.58,37.66 v20.72,38.27
LTXD  (via drill 0.3)
  Top 0.1: U3.1 20.07,39.85 20.61,39.31 v21.1,39 | v25.84,38.77 25.77,38.01 v25.98,37.17 | v29.74,33.21 31.13,33.21 36.24,28.1 40.68,28.1 U2.9
  Bottom 0.1: v21.1,39 22.59,39.07 22.98,38.78 v25.84,38.77 | v25.98,37.17 26.65,37.16 27.26,36.13 27.8,35.44 v29.74,33.21
MISO  (via drill 0.3)
  Top 0.152: U3.16 14.8,35.4 14.8,34.5 15,34.3 15,30.2 14.1,29.3 14.1,27.1 14.5,26.7 14.5,18.8 v14.6,18.7
  Bottom 0.152: v14.6,18.7 14.1,18.2 14.1,17 MISO.TP
MOSI  (via drill 0.3)
  Top 0.152: v12.6,34.7 12.6,35.2 13.4,36 14.4,36 14.7,36.3 15.1,36.3 U3.15 | v12.6,31 11.1,29.5 11.1,24.6 v12.2,23.5
  Bottom 0.152: v12.6,31 v12.6,34.7 | v12.2,23.5 13.7,22 MOSI.TP
N$1
  Top 0.152: ANT1.D 54.6,14.1 52.7,14.1 U2.60
N$2  (via drill 0.3)
  Top 0.152: C16.1 16.3,40.5 16.3,39.9 U3.7 16.3,39.8 16.3,39 v16.2,38.9 | v14.7,40.4 14.7,41.2 14.6,41.3 14.6,43.5 14.7,43.6 15.9,43.6 16.5,43 16.7,43 X1.3
  Bottom 0.152: v14.7,40.4 v16.2,38.9
N$3  (via drill 0.3)
  Top 0.152: v3.5,32.5 2.7,32.5 R16.2 | v8.4,32.4 8.5,32.5 8.5,33.4 8.6,33.5 8.7,33.5 Q6.3
  Bottom 0.152: v3.5,32.5 3.6,32.4 v8.4,32.4
N$4
  Top 0.152: R2.2 49.6,27.6 49,27.6 48.7,27.9 48.3,27.9 48.1,28.1 47.9,28.1 R12.1 47.8,28.1 47.8,28 47.4,28 46.5,28.9 46.5,29.1 Q7.1
N$5
  Top 0.152: R14.2 9.5,34.5 Q5.1 10.3,34.6 10.3,35.3 R20.1
N$6
  Top 0.152: R13.2 5.7,34.5 6.4,34.5 6.6,34.3 Q6.1 6.7,34.4 6.7,35.2 R21.1
N$7
  Top 0.152: R16.1 2.7,34.1 NETLIGHT.-
N$8  (via drill 0.3)
  Top 0.152: v5.2,33 4.8,32.6 4.4,32.6 R15.2 | v12,32.6 12.1,32.7 12.1,33.5 12.3,33.7 Q5.3
  Bottom 0.152: v5.2,33 11.6,33 v12,32.6
N$9
  Top 0.152: R1.2 1.1,33.1 1.1,34.1 POWER.-
N$11
  Top 0.152: R22.1 38.5,36.2 39.1,36.2 R10.2 39.2,36.1 40.2,35.1 40.6,35.1 40.6,35.4 Q1.1
N$12
  Top 0.152: R4.1 54.9,49.7 53.5,49.7 U1.7
N$13
  Top 0.152: U3.8 15.8,39.9 15.8,40.5 C1.1 15.7,40.6 15.6,40.6 15.2,41 15.2,41.3 15.1,41.4 15.1,41.8 15.2,41.9 15.3,41.9 X1.1
N$15  (via drill 0.3)
  Top 0.152: 42.3,37.2 43.3,36.2 43.5,36.2 R9.1 | 42.3,37.2 41.5,37.2 41.5,37.4 Q1.3 | 42.3,37.2 42.3,37.6 v42.6,37.9 | v38.1,44 39,44.9 39,45 U5.G
  Bottom 0.152: v42.6,37.9 38.1,42.4 v38.1,44
N$16
  Top 0.152: R15.1 4.3,33.1 4.3,34.1 STATUS.-
N$17
  Top 0.152: Q2.3 15.4,45.6 15.4,44.8 14.2,43.6 14.2,42.4 14,42.2 12.2,42.2 12.1,42.3 11.7,41.9 11,41.9 Q4.3 10.5,42 8.7,40.2 C23.+
N$38
  Top 0.152: 49.4,44.1 46.6,44.1 D8.-
  pour Top (isolate 0.254, no thermals): 51.69,40.89 50.04,40.89 arc-90 49.4,41.53 49.4,47.24 arc90 48.77,47.88 47.75,47.88 arc-90 47.37,48.26 47.37,48.58 arc-90 47.75,48.96 51.69,48.96 arc-90 52.32,48.32 52.32,41.53 arc-90
N$47
  Top 0.152: 54.8,47.1 54.8,47.4 R5.1 | 54.8,47.1 54.8,47 R6.1 54.8,47.1 | 54.8,47.1 53.5,47.1 U1.5
NETLIGHT  (via drill 0.3)
  Top 0.152: v7.2,37.8 7.2,35.3 R21.2 7.3,35.3 7.5,35.1 7.5,33.7 7.4,33.6 6.3,33.6 5.8,33.1 5.8,32 v6.3,31.5 | v14.2,37.9 14.4,37.9 14.8,38.3 15.1,38.3 U3.11 | v51.2,6.1 52.6,6.1 U2.52 | v29.5,23.8 23.1,30.2 v23.1,31.9
  Bottom 0.152: v7.2,37.8 7.3,37.9 v14.2,37.9 | v51.2,6.1 33.5,23.8 v29.5,23.8 | v23.1,31.9 23,31.8 20.9,31.8 20.8,31.9 15.4,31.9 13.9,30.4 7.4,30.4 v6.3,31.5
PANEL  (via drill 0.3)
  Top 0.152: 26.9,47.3 26.9,47 25.6,45.7 25.4,45.7 25.2,45.9 C6.2 25.1,45.9 24.51,45.55 23.7,44.74 23.7,44 U4.3 | 26.9,47.3 26.9,47.6 26.7,47.8 26.5,47.8 R26.2 | 43.7,37.4 43.7,37.5 44.9,38.7 44.9,44.7 43.9,45.7 43.81,45.7 | 43.7,37.4 43.7,36.7 43.6,36.7 R9.2 | D1.A 55.8,55.9 54.7,55.9 54.7,56.1 52.9,57.9 45.6,57.9 45.6,53.1 43.9,51.4 43.81,51.4 | 43.7,37.4 v43.8,37.4 | v27.2,47.3 26.9,47.3
  Bottom 0.152: PANEL.TP 15.1,26.5 19.3,30.7 33.2,30.7 36.2,33.7 42.9,33.7 44.4,35.2 44.4,37.4 v43.8,37.4 | v27.2,47.3 27.5,47.6 29.2,47.6 30.7,49.1 38.5,49.1 39.3,49.9 39.9,49.9 PANEL+.P$1
  pour Top (isolate 0.305, rank 2, no thermals): 43.31,43.94 arc90 43.81,44.45 43.81,52.7 arc90 43.18,53.34 38.76,53.34 arc90 37.85,52.42 37.85,47.85 arc90 38.84,46.86 39.24,46.86 arc-90 39.88,46.23 39.88,43.94
PANEL_CURRENT  (via drill 0.3)
  Top 0.152: v19.3,34.2 19.3,34.3 18.8,34.8 18.8,35.1 U3.23 | v25,34.4 26,35.4 26,35.82 26.61,36.25 26.6,38.05 26.6,38.08 26.43,38.25 26.37,39.17 26,39.6 25,40.6 23.1,40.6 23.1,40.8 22.3,41.6 22.3,42.7 22.5,42.9 22.5,43 22.8,43.3 22.8,43.9 U4.2
  Bottom 0.152: v19.3,34.2 19.5,34.4 v25,34.4
PANEL_EN  (via drill 0.3)
  Top 0.152: v38.6,37.4 38.6,36.9 38.5,36.8 R22.2 | v36.69,40.89 v36.8,39.2 | v11.8,40.5 11.7,40.4 11.7,40.2 12.7,39.2 15.1,39.2 U3.9
  Bottom 0.152: v36.8,39.2 v38.6,37.4 | v36.69,40.89 34.4,43.5 28.7,43.5 28,44.2 15.5,44.2 v11.8,40.5
PANEL_SWITCH  (via drill 0.3)
  Top 0.152: v45.8,37.7 45.8,37 R7.1 | v44,39 43.9,39.1 43.8,39.12
  Bottom 0.152: v45.8,37.7 44.5,39 v44,39
  pour Top (isolate 0.254, no thermals): 32.51,39.24 32.51,42.55 arc-90 33.15,43.18 43.18,43.18 arc-90 43.81,42.55 43.81,39.24 arc-90 43.18,38.61 33.15,38.61 arc-90
  pour Top: 33.43,43.25 arc-23 33.58,43.28 37.54,43.28 arc-90 38.54,42.28 arc-90 38.25,41.99 34.43,41.99 arc-90 33.43,42.99
PANEL_VOLTAGE  (via drill 0.3)
  Top 0.152: 23.1,46.1 23.1,46 23.2,45.9 23.2,45.8 23.3,45.7 24.1,45.7 24.4,46 24.4,46.2 24.6,46.4 25.4,46.4 26.4,47.4 R26.1 | 23.1,46.1 23.1,46.3 22.8,46.6 22.8,46.8 R27.2 | U3.24 20.6,33.8 20.6,31.4 v20.5,31.3 | v33,33.8 33.6,34.4 33.9,34.4 33.9,34.2 C14.1 | v22.9,46.1 23.1,46.1 | v27.2,46.1 27.2,43.4 27,43.2 27.06,39.73 27.47,39.38 27.56,39.29 27.56,38.1 27.48,38.02 27.48,37.95 27.49,35.61 26.57,35.61 26.56,34.76 26.93,34.46 26.94,33.5 26.6,33.1 v26.6,32.9
  Bottom 0.152: 26.6,31.3 29.7,31.3 32.2,33.8 v33,33.8 | 26.6,31.3 v20.5,31.3 | v27.2,46.1 v22.9,46.1 | 26.6,31.3 v26.6,32.9
PFET_GATE  (via drill 0.3)
  Top 0.152: 20.4,41.2 20.3,41.2 20.3,42.3 Q3.3 | 20.4,41.2 20.6,41.2 20.8,41 v21.2,41 | v13.7,40 13.6,40.1 13.6,41 13.5,41.1 13.2,41.1 Q4.1 | 20.4,41.2 R23.1
  Bottom 0.152: v21.2,41 19.9,39.7 18.8,39.7 16.5,37.4 15.9,37.4 13.7,39.6 v13.7,40
PWRKEY  (via drill 0.3)
  Top 0.2: U2.1 49.64,26.14 49.64,26.57 v49.62,26.57 | v48.37,30.34 47.49,30.39 47.35,30.36 Q7.3
  Bottom 0.2: v49.62,26.57 49.62,30.33 v48.37,30.34
RSENSE+  (via drill 0.3)
  Top 0.152: R7.2 45.9,36.4 45.2,35.7 44.9,35.7 C10.1 44.8,35.7 44,35.7 v43.8,35.5 | v23.7,47.7 23.7,46.6 U4.4
  Bottom 0.152: v23.7,47.7 24.7,46.7 32.73,46.56 37.17,41.25 37.17,40.76 37.31,40.62 38.53,40.63 v43.8,35.5
RSENSE-  (via drill 0.3)
  Top 0.152: R11.2 37.7,36.2 37.2,36.2 36.7,35.7 C12.1 36.6,35.7 36,35.7 v34.4,37.3 | v26.95,38.84 26.72,39.28 26.72,39.88 26.37,40.23 26.4,44.6 v26.2,44.8 | v22.2,45.4 21.8,45.8 21.8,46.5 U4.5
  Bottom 0.152: v34.4,37.3 32.8,38.9 v26.95,38.84 | v26.2,44.8 25.6,45.4 v22.2,45.4
RST  (via drill 0.3)
  Top 0.152: R3.1 10.8,36.1 10.8,37 C8.1 10.8,37.1 10.8,38.5 v11.6,39.3 | v19.6,41.2 19.9,40.9 19.9,40.28 20.3,40.2 20.47,39.99 20.93,39.54 21.67,39.54 21.67,38.31 21.66,38.26 21.17,37.72 19.87,37.72 U3.29
  Bottom 0.152: v19.6,41.2 19.4,41 13.3,41 v11.6,39.3 0.8,39.3 0.8,16 1.9,14.9 10,14.9 12.9,12 RST.TP
RX  (via drill 0.3)
  Top 0.152: v18.9,36.2 18.9,38.3 19.8,38.3 U3.30 | v22.6,35.6 22.4,35.4 22.4,33.4 21.7,32.7 v21.7,23.6
  Bottom 0.152: v18.9,36.2 22,36.2 v22.6,35.6 | v21.7,23.6 20.1,22 RX.TP 17.9,22 15.8,19.9 5.3,19.9 3.4,21.8 2.6,21.8 TTL.3
SCK  (via drill 0.3)
  Top 0.152: v15.1,24 15.1,26.4 15.9,27.2 15.9,29.3 15.4,29.8 15.4,34.5 15.8,34.9 15.8,35.1 U3.17
  Bottom 0.152: v15.1,24 15,24.1 11.7,24.1 9.6,22 SCK.TP
SCL  (via drill 0.3)
  Top 0.152: 30.6,37 29.9,37 29.7,36.8 U7.6 30.6,37 | 30.6,37 R31.1 | v22.1,40.47 22.1,39.1 22.01,38.84 21.97,38.71 21.97,38.07 21.3,37.4 20.55,37.29 20.4,37.3 19.9,37.3 U3.28 | v27.63,40.43 27.96,40.13 27.97,39.08 28.5,38.7 30.8,38.7 31,38.5 31,37.7 30.6,37.3 30.6,37
  Bottom 0.152: v27.63,40.43 v22.1,40.47
SDA  (via drill 0.3)
  Top 0.152: R32.1 29.7,35.5 U7.5 29.6,35.6 28.3,35.6 v28.09,36.08 | v22.5,38.44 22.5,38.04 22.1,37.64 21.74,37.32 21.03,36.84 20.7,36.8 19.9,36.8 U3.27
  Bottom 0.152: v22.5,38.44 25,38.44 25.21,38.22 27.48,38.22 27.7,38.4 28.3,38.4 28.6,38.1 28.59,36.1 v28.09,36.08
SIM_CLK
  Top 0.152: R18.2 25.9,6.4 26.9,7.4 26.9,7.8 27.2,8.1 28.6,8.1 U2.32
SIM_CLK_DIRECT  (via drill 0.3)
  Top 0.152: 13.5,6.9 13.5,4.8 12.5,3.8 12.5,3 SIMHOLDER.3 | 13.5,6.9 13.5,7 17.8,7 18.1,6.7 24.2,6.7 24.4,6.5 24.8,6.5 24.9,6.4 25.3,6.4 R18.1 | 13.5,6.9 v10.7,6.9
  Bottom 0.152: VCC1.TP 10.1,7.5 v10.7,6.9
SIM_DATA
  Top 0.152: R19.1 25.8,7.1 25.8,7.6 26.9,8.7 26.9,8.8 27.4,9.3 27.6,9.3 27.7,9.4 28.4,9.4 28.4,9.2 28.5,9.1 28.6,9.1 U2.31
SIM_DATA_DIRECT  (via drill 0.3)
  Top 0.152: R19.2 25.3,7.1 12.8,19.6 12.8,27.3 12.5,27.6 12.5,28.2 SIMHOLDER.4 12.6,27.4 v11.9,26.7
  Bottom 0.152: GND11.TP 10.2,26.5 10.4,26.7 v11.9,26.7
SIM_RST
  Top 0.152: R17.2 25.9,5.5 26.5,5.5 26.9,5.9 26.9,6.8 27.2,7.1 28.6,7.1 U2.33
SIM_RST_DIRECT  (via drill 0.3)
  Top 0.152: R17.1 25.3,5.5 24.8,5.5 20.3,1 16,1 16,1.1 14.9,2.2 14.9,2.9 SIMHOLDER.2 14.9,3 14.9,3.6 14.8,3.7 v14.8,4.6
  Bottom 0.152: SCK1.TP 14,6.3 14.8,5.5 v14.8,4.6
SIM_VDD  (via drill 0.3)
  Top 0.152: U2.30 28.6,10.2 28.4,10 28.4,9.8 26.8,9.8 C20.1 26.7,9.8 v25.7,9.8 | v18,5.9 17.5,5.4 17.5,3 SIMHOLDER.1
  Bottom 0.152: v18,5.9 18.5,6.4 18.5,7.5 RST1.TP 19.7,7.5 19.9,7.7 23.6,7.7 v25.7,9.8
STATUS  (via drill 0.3)
  Top 0.152: 12.85,37.85 13.8,38.8 15.1,38.8 U3.10 | 12.85,37.85 11.2,36.2 11.2,35.8 10.8,35.4 R20.2 | v51.2,20.1 52.6,20.1 U2.66 | 12.85,37.85 v12.2,38.5
  Bottom 0.152: v51.2,20.1 46.9,24.4 15.6,24.4 15.4,24.6 14.8,24.6 14.7,24.5 9.6,24.5 9.5,24.4 6.8,24.4 3,28.2 2.4,28.2 1.6,29 1.6,38.5 v12.2,38.5
TX  (via drill 0.3)
  Top 0.152: v18,36.2 18,38.8 19.8,38.8 U3.31 | v21.1,35.6 21.1,19.7 v20,18.6
  Bottom 0.152: v18,36.2 18.6,35.6 v21.1,35.6 | v20,18.6 19.5,18.1 19.5,17 TX.TP 17.9,17 15.6,19.3 4.7,19.3 4.5,19.5 4,19.5 3.7,19.2 2.9,19.2 TTL.2
VCC  (via drill 0.3)
  Top 0.152: 12.8,46.9 12.8,47.6 8,52.4 8,52.5 7.8,52.7 7.8,53.1 U$1.P$1 | 12.8,46.9 12.8,43 13.2,43 Q4.2 | v30.7,48.2 29.4,49.5 22.1,49.5 22.1,48.2 20.8,46.9 18.8,46.9 18.2,47.5 17.2,47.5 16.6,46.9 12.8,46.9
  Bottom 0.1: v54.75,29.31 54.8,29.26 55.8,29.26 v58.03,29.26
  Bottom 0.152: 55.8,29.26 55.8,29.9 37.5,48.2 v30.7,48.2
VDD
  Top 0.152: 47.7,49.7 48,49.7 U1.2 48.1,49.7 | 46.4,49.3 C24.2 | 55.4,49.5 55.4,49.7 R4.2 55.4,49.8 | 54.9,49 54.9,48.6 C11.2 | 51.4,55.2 D1.C 51.4,55.9 48,55.9 D2.C | 52.9,53.5 52.9,53.6 52.95,53.65
  Top 0.2: 54.9,49 55.4,49.5
  Top 0.406: 46.4,49.3 47.3,49.3 47.7,49.7 | 55.4,49.8 55.4,50.1 55.2,50.3 55.2,51.4 52.95,53.65 51.4,55.2 | 48.1,49.7 49.1,49.7 52.9,53.5
VROUTE  (via drill 0.3)
  Top 0.152: 55.3,46.9 R6.2 | 55.49,28.97 55.4,28.8 55.2,28.6 55.2,27.4 58.2,24.4 58.2,15.5 58.7,15 58.7,11.9 58.3,11.5 58.29,11.43 | v4.4,18.7 4.6,18.7 4.6,22.3 2.9,24 2.9,24.3 TTL.4 2.9,24.4 2.9,24.7 1.2,26.4 1.2,31.3 1.6,31.7 1.6,33.5 1.8,33.7 1.8,34.5 1.2,35.1 1.2,35.6 | 1.2,35.6 2.6,35.6 NETLIGHT.+ 2.7,35.6 4.3,35.6 STATUS.+ 4.4,35.7 4.4,35.9 6.9,38.4 9.4,38.4 10.1,37.7 10.1,36.6 10.15,36.55 | 1.2,35.6 1.1,35.6 POWER.+ 1.2,35.6 | 10.15,36.55 10.3,36.4 10.3,36.1 R3.2 | v12.6,36.1 12.6,36.3 12.9,36.6 13.8,36.6 C7.2 | v9.6,36.1 9.9,36.4 10,36.4 10.15,36.55 | 17,35.8 17.1,35.8 17.1,35.6 17.3,35.4 17.3,35.2 U3.20 17.3,35.1 17.3,34.5 18.7,33.1 18.7,32.7 | 17,35.8 16.6,35.8 16.3,35.5 16.3,35.2 U3.18 | 17.05,39.25 17.1,39.2 17.6,39.2 17.6,39.4 17.8,39.6 17.8,39.8 U3.4 | 17.05,39.25 16.8,39.5 16.8,39.8 U3.6 | 17,35.8 17,39.2 17.05,39.25 | v14.3,31.7 14.1,31.9 14.1,32.6 C17.2 13.6,32.6 13,32 11.7,32 11.4,32.3 11.4,32.9 11.5,33 11.5,34.4 v11.4,34.5 | 18.7,32.7 19.6,32.7 19.6,32.9 C2.+ | 18.7,32.7 18.6,32.7 v18.5,32.6 18.7,32.7 | 27.7,34 27.7,33.7 27.6,33.6 27.6,32.3 24.9,32.3 24.4,32.8 C18.2 22.7,32.8 v22.3,32.4 | 31.8,35.5 31.8,35.7 31.6,35.9 31.6,36.6 31.8,36.8 31.8,37 | 31.8,37 31.8,37.2 31.6,37.4 31.6,38.7 30.7,39.6 30.1,39.6 30.1,39.5 30,39.4 29.7,39.4 U7.8 | 31.8,37 R31.2 | 27.7,34 28.6,34 29.01,34.16 31.41,34.16 | 31.41,34.16 31.4,34.9 31.8,35.3 31.8,35.5 | 27.7,34 C26.1 | 31.8,35.5 R32.2 | 31.41,34.16 v34.6,31.2 | v52.8,31.2 53.01,31.26
  Top 0.406: 55.3,46.9 55.3,46 56.2,45.1 56.2,44.32
  Bottom 0.152: VCC.TP 7.9,17 6.2,18.7 v4.4,18.7 | v9.6,36.1 11.4,36.1 | 11.4,36.1 v12.6,36.1 | v14.3,31.7 15.2,32.6 v18.5,32.6 18.7,32.4 v22.3,32.4 | v11.4,34.5 11.4,36.1 | v34.6,31.2 v52.8,31.2
  pour Top (isolate 0.254, no thermals): 51.84,11.43 58.24,11.43 arc-90 58.43,11.24 58.43,9.01 arc-90 58.25,8.83 51.88,8.83 arc-90 51.7,9.01 51.7,11.29 arc-90
  pour Top (isolate 0.254, no thermals): 53.01,31.26 53.01,29.36 arc90 53.39,28.97 57.96,28.97 arc90 58.34,29.36 58.04,43.94 arc90 57.66,44.32 55.5,44.32 arc90 55.12,43.94 55.42,32.02 arc-90 55.04,31.64 53.39,31.64 arc90
VRTC
  Top 0.152: C15.+ 26.5,14.2 28.6,14.2 U2.26
WP  (via drill 0.3)
  Top 0.152: v12,35.4 12,36.4 12.3,36.7 12.4,36.7 13,37.3 15.1,37.3 U3.13 | v21.7,33.6 22,33.9 22,36.1 v22.7,36.8 | v28.05,37.78 28.5,38.3 29.6,38.3 29.6,38.2 U7.7
  Bottom 0.152: v12,35.4 12.1,35.3 14,35.3 15.7,33.6 v21.7,33.6 | v22.7,36.8 23.7,37.8 v28.05,37.78

### Text on the board
tPlace: PANEL- | SIMHOLDER | january 18, 2014
tNames: NET
bNames: SIM_IO | SIM_CLK | SIM_RST | SIM_VDD | GND | GND